# Altium schematic sheet Voltage Shifters.SchDoc
size A4; DocumentNumber: 3; SheetNumber: 5; SheetTotal: 7
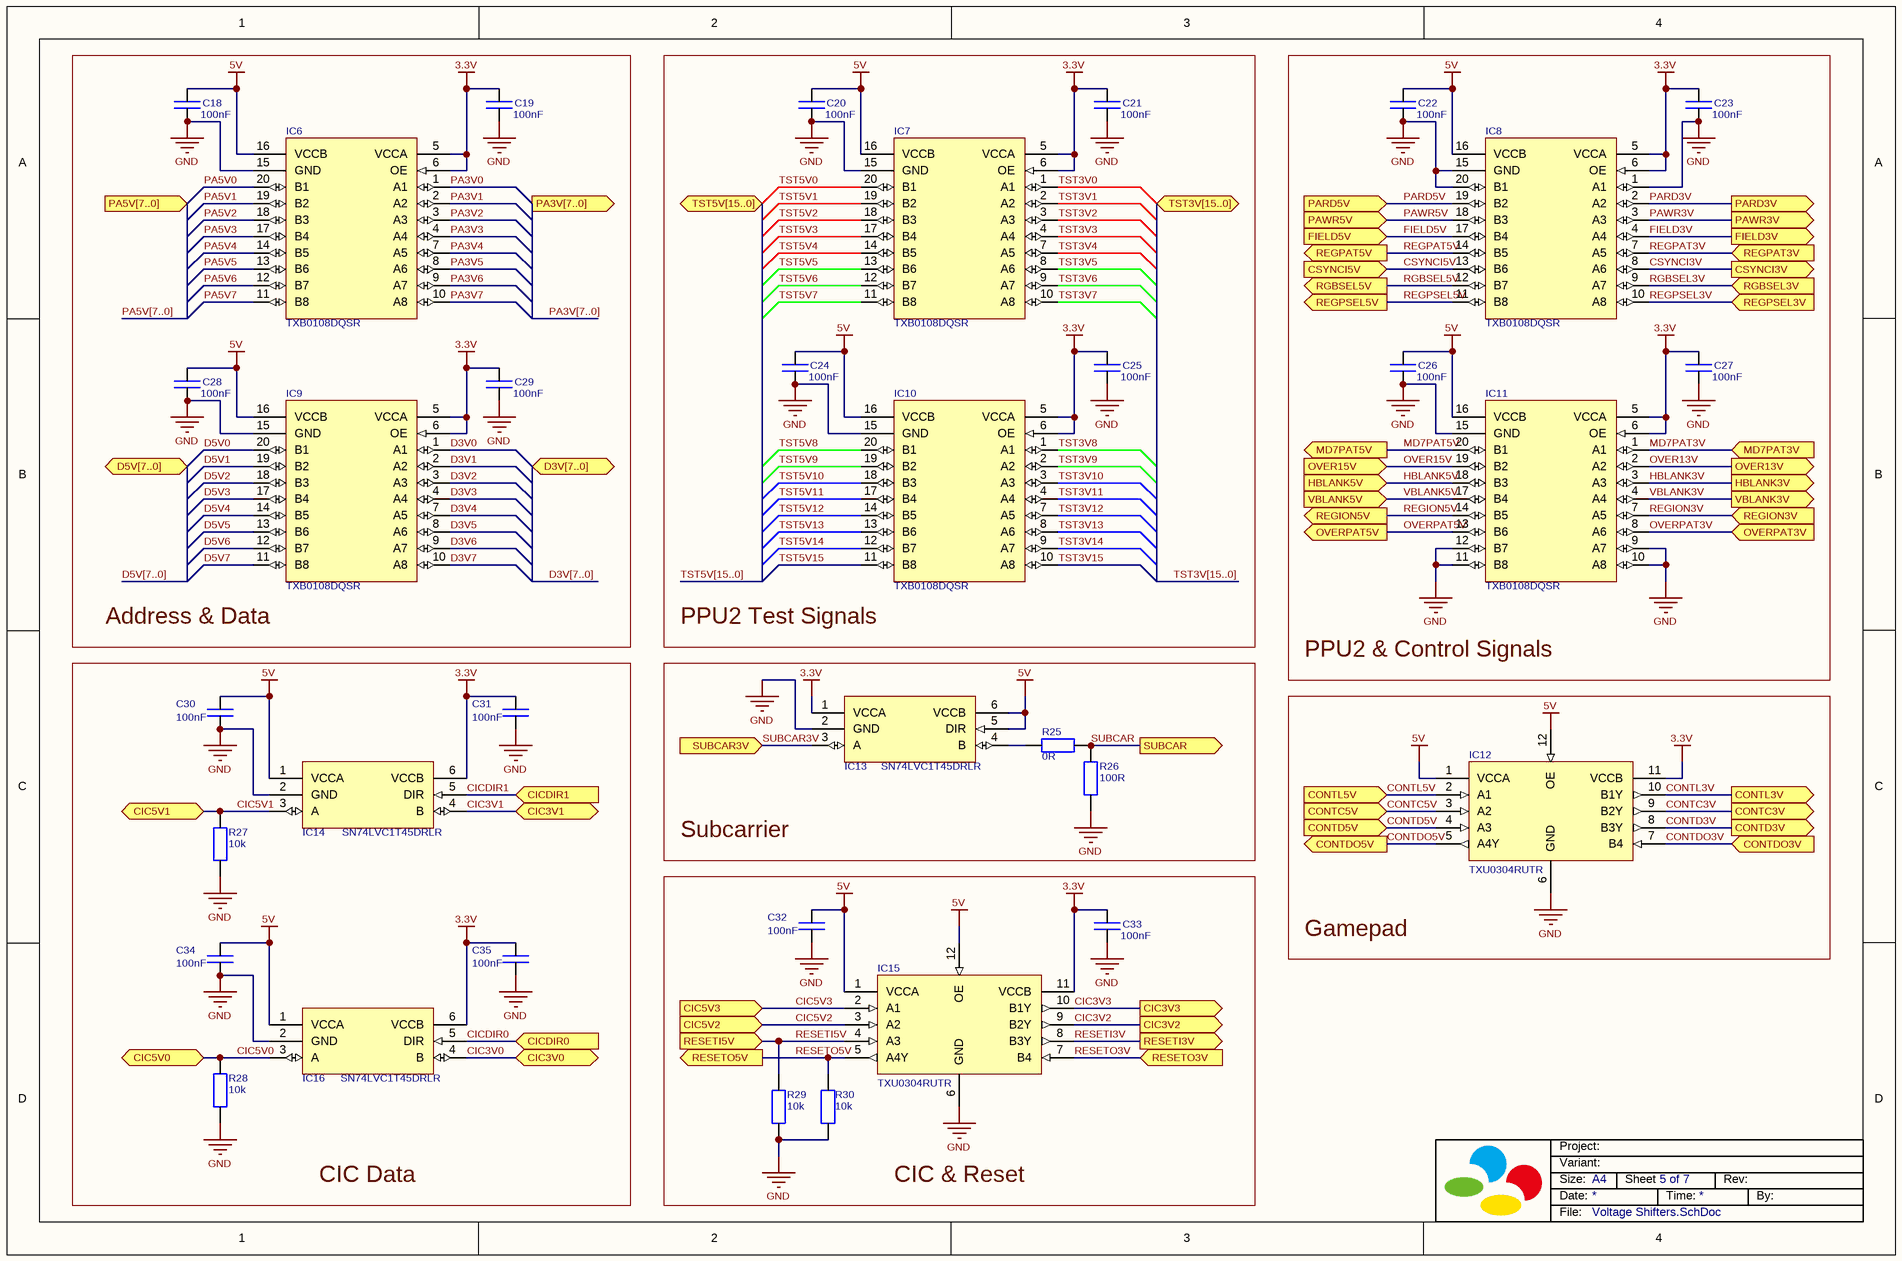
[diagram p0: Voltage Shifters.SchDoc]

## Parts
C18  value 100nF  [Cap_0402_Chip]  (hidden comment: Ceramic Capacitor 100nF 10V ±20% X7R 0402)
C19  value 100nF  [Cap_0402_Chip]  (hidden comment: Ceramic Capacitor 100nF 10V ±20% X7R 0402)
C20  value 100nF  [Cap_0402_Chip]  (hidden comment: Ceramic Capacitor 100nF 10V ±20% X7R 0402)
C21  value 100nF  [Cap_0402_Chip]  (hidden comment: Ceramic Capacitor 100nF 10V ±20% X7R 0402)
C22  value 100nF  [Cap_0402_Chip]  (hidden comment: Ceramic Capacitor 100nF 10V ±20% X7R 0402)
C23  value 100nF  [Cap_0402_Chip]  (hidden comment: Ceramic Capacitor 100nF 10V ±20% X7R 0402)
C24  value 100nF  [Cap_0402_Chip]  (hidden comment: Ceramic Capacitor 100nF 10V ±20% X7R 0402)
C25  value 100nF  [Cap_0402_Chip]  (hidden comment: Ceramic Capacitor 100nF 10V ±20% X7R 0402)
C26  value 100nF  [Cap_0402_Chip]  (hidden comment: Ceramic Capacitor 100nF 10V ±20% X7R 0402)
C27  value 100nF  [Cap_0402_Chip]  (hidden comment: Ceramic Capacitor 100nF 10V ±20% X7R 0402)
C28  value 100nF  [Cap_0402_Chip]  (hidden comment: Ceramic Capacitor 100nF 10V ±20% X7R 0402)
C29  value 100nF  [Cap_0402_Chip]  (hidden comment: Ceramic Capacitor 100nF 10V ±20% X7R 0402)
C30  value 100nF  [Cap_0402_Chip]  (hidden comment: Ceramic Capacitor 100nF 10V ±20% X7R 0402)
C31  value 100nF  [Cap_0402_Chip]  (hidden comment: Ceramic Capacitor 100nF 10V ±20% X7R 0402)
C32  value 100nF  [Cap_0402_Chip]  (hidden comment: Ceramic Capacitor 100nF 10V ±20% X7R 0402)
C33  value 100nF  [Cap_0402_Chip]  (hidden comment: Ceramic Capacitor 100nF 10V ±20% X7R 0402)
C34  value 100nF  [Cap_0402_Chip]  (hidden comment: Ceramic Capacitor 100nF 10V ±20% X7R 0402)
C35  value 100nF  [Cap_0402_Chip]  (hidden comment: Ceramic Capacitor 100nF 10V ±20% X7R 0402)
IC6  TXB0108DQSR  [SON20]
IC7  TXB0108DQSR  [SON20]
IC8  TXB0108DQSR  [SON20]
IC9  TXB0108DQSR  [SON20]
IC10  TXB0108DQSR  [SON20]
IC11  TXB0108DQSR  [SON20]
IC12  Manufacturer_Part_Number: TXU0304RUTR  [UQFN12]  (hidden comment: TXU0304)
IC13  Manufacturer_Part_Number: SN74LVC1T45DRLR  [SOT-5X3]  (hidden comment: SN74LVC1T45)
IC14  Manufacturer_Part_Number: SN74LVC1T45DRLR  [SOT-5X3]  (hidden comment: SN74LVC1T45)
IC15  Manufacturer_Part_Number: TXU0304RUTR  [UQFN12]  (hidden comment: TXU0304)
IC16  Manufacturer_Part_Number: SN74LVC1T45DRLR  [SOT-5X3]  (hidden comment: SN74LVC1T45)
R25  value 0R  [Res_0603_Chip]  (hidden comment: Resistor 0R 0603 ±1%)
R26  value 100R  [Res_0603_Chip]  (hidden comment: Resistor 100R 0603 ±1%)
R27  value 10k  [Res_0402_Chip]  (hidden comment: Resistor 10k 0402 ±1%)
R28  value 10k  [Res_0402_Chip]  (hidden comment: Resistor 10k 0402 ±1%)
R29  value 10k  [Res_0402_Chip]  (hidden comment: Resistor 10k 0402 ±1%)
R30  value 10k  [Res_0402_Chip]  (hidden comment: Resistor 10k 0402 ±1%)

## Blocks framed on the sheet
Address & Data: C18 C19 C28 C29 IC6 IC9
PPU2 Test Signals: C20 C21 C24 C25 IC7 IC10
PPU2 & Control Signals: C22 C23 C26 C27 IC8 IC11
CIC Data: C30 C31 C34 C35 IC14 IC16 R27 R28
Subcarrier: IC13 R25 R26
Gamepad: IC12
CIC & Reset: C32 C33 IC15 R29 R30

## Ports
CIC3V0 (bidir), CIC3V1 (bidir), CIC3V2 (out), CIC3V3 (out), CIC5V0 (bidir), CIC5V1 (bidir), CIC5V2 (in), CIC5V3 (in), CICDIR0 (in), CICDIR1 (in), CONTC3V (out), CONTC5V (in), CONTD3V (out), CONTD5V (in), CONTDO3V (in), CONTDO5V (out), CONTL3V (out), CONTL5V (in), CSYNCI3V (out), CSYNCI5V (in), D3V[7..0] (bidir), D5V[7..0] (bidir), FIELD3V (out), FIELD5V (in), HBLANK3V (out), HBLANK5V (in), MD7PAT3V (in), MD7PAT5V (out), OVER13V (out), OVER15V (in), OVERPAT3V (in), OVERPAT5V (out), PA3V[7..0] (out), PA5V[7..0] (in), PARD3V (out), PARD5V (in), PAWR3V (out), PAWR5V (in), REGION3V (in), REGION5V (out), REGPAT3V (in), REGPAT5V (out), REGPSEL3V (in), REGPSEL5V (out), RESETI3V (out), RESETI5V (in), RESETO3V (in), RESETO5V (out), RGBSEL3V (in), RGBSEL5V (out), SUBCAR3V (in), SUBCAR (out), TST3V[15..0] (bidir), TST5V[15..0] (bidir), VBLANK3V (out), VBLANK5V (in)

## Nets
3.3V: C19.1 C21.1 C23.1 C25.1 C27.1 C29.1 C31.1 C33.1 C35.1 IC6.5(VCCA) IC6.6(OE) IC7.5(VCCA) IC7.6(OE) IC8.5(VCCA) IC8.6(OE) IC9.5(VCCA) IC9.6(OE) IC10.5(VCCA) IC10.6(OE) IC11.5(VCCA) IC11.6(OE) IC12.11(VCCB) IC13.1(VCCA) IC14.6(VCCB) IC15.11(VCCB) IC16.6(VCCB)
5V: C18.1 C20.1 C22.1 C24.1 C26.1 C28.1 C30.1 C32.1 C34.1 IC6.16(VCCB) IC7.16(VCCB) IC8.16(VCCB) IC9.16(VCCB) IC10.16(VCCB) IC11.16(VCCB) IC12.1(VCCA) IC12.12(OE) IC13.5(DIR) IC13.6(VCCB) IC14.1(VCCA) IC15.1(VCCA) IC15.12(OE) IC16.1(VCCA)
GND: C18.2 C19.2 C20.2 C21.2 C22.2 C23.2 C24.2 C25.2 C26.2 C27.2 C28.2 C29.2 C30.2 C31.2 C32.2 C33.2 C34.2 C35.2 IC6.15(GND) IC7.15(GND) IC8.1(A1) IC8.15(GND) IC8.20(B1) IC9.15(GND) IC10.15(GND) IC11.9(A7) IC11.10(A8) IC11.11(B8) IC11.12(B7) IC11.15(GND) IC12.6(GND) IC13.2(GND) IC14.2(GND) IC15.6(GND) IC16.2(GND) R26.2 R27.1 R28.1 R29.2 R30.1
CIC3V0: IC16.4(B) ; port CIC3V0
CIC3V1: IC14.4(B) ; port CIC3V1
CIC3V2: IC15.9(B2Y) ; port CIC3V2
CIC3V3: IC15.10(B1Y) ; port CIC3V3
CIC5V0: IC16.3(A) R28.2 ; port CIC5V0
CIC5V1: IC14.3(A) R27.2 ; port CIC5V1
CIC5V2: IC15.3(A2) ; port CIC5V2
CIC5V3: IC15.2(A1) ; port CIC5V3
CICDIR0: IC16.5(DIR) ; port CICDIR0
CICDIR1: IC14.5(DIR) ; port CICDIR1
CONTC3V: IC12.9(B2Y) ; port CONTC3V
CONTC5V: IC12.3(A2) ; port CONTC5V
CONTD3V: IC12.8(B3Y) ; port CONTD3V
CONTD5V: IC12.4(A3) ; port CONTD5V
CONTDO3V: IC12.7(B4) ; port CONTDO3V
CONTDO5V: IC12.5(A4Y) ; port CONTDO5V
CONTL3V: IC12.10(B1Y) ; port CONTL3V
CONTL5V: IC12.2(A1) ; port CONTL5V
CSYNCI3V: IC8.8(A6) ; port CSYNCI3V
CSYNCI5V: IC8.13(B6) ; port CSYNCI5V
D3V0: IC9.1(A1)
D3V1: IC9.2(A2)
D3V2: IC9.3(A3)
D3V3: IC9.4(A4)
D3V4: IC9.7(A5)
D3V5: IC9.8(A6)
D3V6: IC9.9(A7)
D3V7: IC9.10(A8)
D5V0: IC9.20(B1)
D5V1: IC9.19(B2)
D5V2: IC9.18(B3)
D5V3: IC9.17(B4)
D5V4: IC9.14(B5)
D5V5: IC9.13(B6)
D5V6: IC9.12(B7)
D5V7: IC9.11(B8)
FIELD3V: IC8.4(A4) ; port FIELD3V
FIELD5V: IC8.17(B4) ; port FIELD5V
HBLANK3V: IC11.3(A3) ; port HBLANK3V
HBLANK5V: IC11.18(B3) ; port HBLANK5V
MD7PAT3V: IC11.1(A1) ; port MD7PAT3V
MD7PAT5V: IC11.20(B1) ; port MD7PAT5V
OVER13V: IC11.2(A2) ; port OVER13V
OVER15V: IC11.19(B2) ; port OVER15V
OVERPAT3V: IC11.8(A6) ; port OVERPAT3V
OVERPAT5V: IC11.13(B6) ; port OVERPAT5V
PA3V0: IC6.1(A1)
PA3V1: IC6.2(A2)
PA3V2: IC6.3(A3)
PA3V3: IC6.4(A4)
PA3V4: IC6.7(A5)
PA3V5: IC6.8(A6)
PA3V6: IC6.9(A7)
PA3V7: IC6.10(A8)
PA5V0: IC6.20(B1)
PA5V1: IC6.19(B2)
PA5V2: IC6.18(B3)
PA5V3: IC6.17(B4)
PA5V4: IC6.14(B5)
PA5V5: IC6.13(B6)
PA5V6: IC6.12(B7)
PA5V7: IC6.11(B8)
PARD3V: IC8.2(A2) ; port PARD3V
PARD5V: IC8.19(B2) ; port PARD5V
PAWR3V: IC8.3(A3) ; port PAWR3V
PAWR5V: IC8.18(B3) ; port PAWR5V
REGION3V: IC11.7(A5) ; port REGION3V
REGION5V: IC11.14(B5) ; port REGION5V
REGPAT3V: IC8.7(A5) ; port REGPAT3V
REGPAT5V: IC8.14(B5) ; port REGPAT5V
REGPSEL3V: IC8.10(A8) ; port REGPSEL3V
REGPSEL5V: IC8.11(B8) ; port REGPSEL5V
RESETI3V: IC15.8(B3Y) ; port RESETI3V
RESETI5V: IC15.4(A3) R29.1 ; port RESETI5V
RESETO3V: IC15.7(B4) ; port RESETO3V
RESETO5V: IC15.5(A4Y) R30.2 ; port RESETO5V
RGBSEL3V: IC8.9(A7) ; port RGBSEL3V
RGBSEL5V: IC8.12(B7) ; port RGBSEL5V
SUBCAR: R25.1 R26.1 ; port SUBCAR
SUBCAR3V: IC13.3(A) ; port SUBCAR3V
TST3V0: IC7.1(A1)
TST3V1: IC7.2(A2)
TST3V2: IC7.3(A3)
TST3V3: IC7.4(A4)
TST3V4: IC7.7(A5)
TST3V5: IC7.8(A6)
TST3V6: IC7.9(A7)
TST3V7: IC7.10(A8)
TST3V8: IC10.1(A1)
TST3V9: IC10.2(A2)
TST3V10: IC10.3(A3)
TST3V11: IC10.4(A4)
TST3V12: IC10.7(A5)
TST3V13: IC10.8(A6)
TST3V14: IC10.9(A7)
TST3V15: IC10.10(A8)
TST5V0: IC7.20(B1)
TST5V1: IC7.19(B2)
TST5V2: IC7.18(B3)
TST5V3: IC7.17(B4)
TST5V4: IC7.14(B5)
TST5V5: IC7.13(B6)
TST5V6: IC7.12(B7)
TST5V7: IC7.11(B8)
TST5V8: IC10.20(B1)
TST5V9: IC10.19(B2)
TST5V10: IC10.18(B3)
TST5V11: IC10.17(B4)
TST5V12: IC10.14(B5)
TST5V13: IC10.13(B6)
TST5V14: IC10.12(B7)
TST5V15: IC10.11(B8)
VBLANK3V: IC11.4(A4) ; port VBLANK3V
VBLANK5V: IC11.17(B4) ; port VBLANK5V
NetIC13_4: IC13.4(B) R25.2

## Buses and harness runs
bus D3V[7..0] = port D3V[7..0]
bus D5V[7..0] = port D5V[7..0]
bus PA3V[7..0] = port PA3V[7..0]
bus PA5V[7..0] = port PA5V[7..0]
bus TST3V[15..0] = port TST3V[15..0]
bus TST5V[15..0] = port TST5V[15..0]

## Notes on the sheet
- Size:
- Date:
- Variant:
- Project:
- A4
- Sheet
- Time:
- Rev:
- By:
- File:

## Library data of the parts
C18-C35 = Capacitor: ChipSize: 0402; NominalVoltage: 10V; Dielectric: X7R; Tolerance: ±20%; PartType: Ceramic Capacitor
IC6-IC11 = TXB0108DQSR: 8-bit level shifter; Manufacturer: Texas Instruments; Manufacturer_Part_Number: TXB0108DQSR
IC12 IC15 = TXU0304: 4-bit level shifter; Manufacturer: Texas Instruments
IC13 IC14 IC16 = SN74LVC1T45: 1-bit Transceiver; Manufacturer: Texas Instruments
R25 R26 = R: ChipSize: 0603; Tolerance: ±1%; PartType: Resistor
R27-R30 = R: ChipSize: 0402; Tolerance: ±1%; PartType: Resistor